# EAGLE schematic motorplank (EAGLE 6.2)
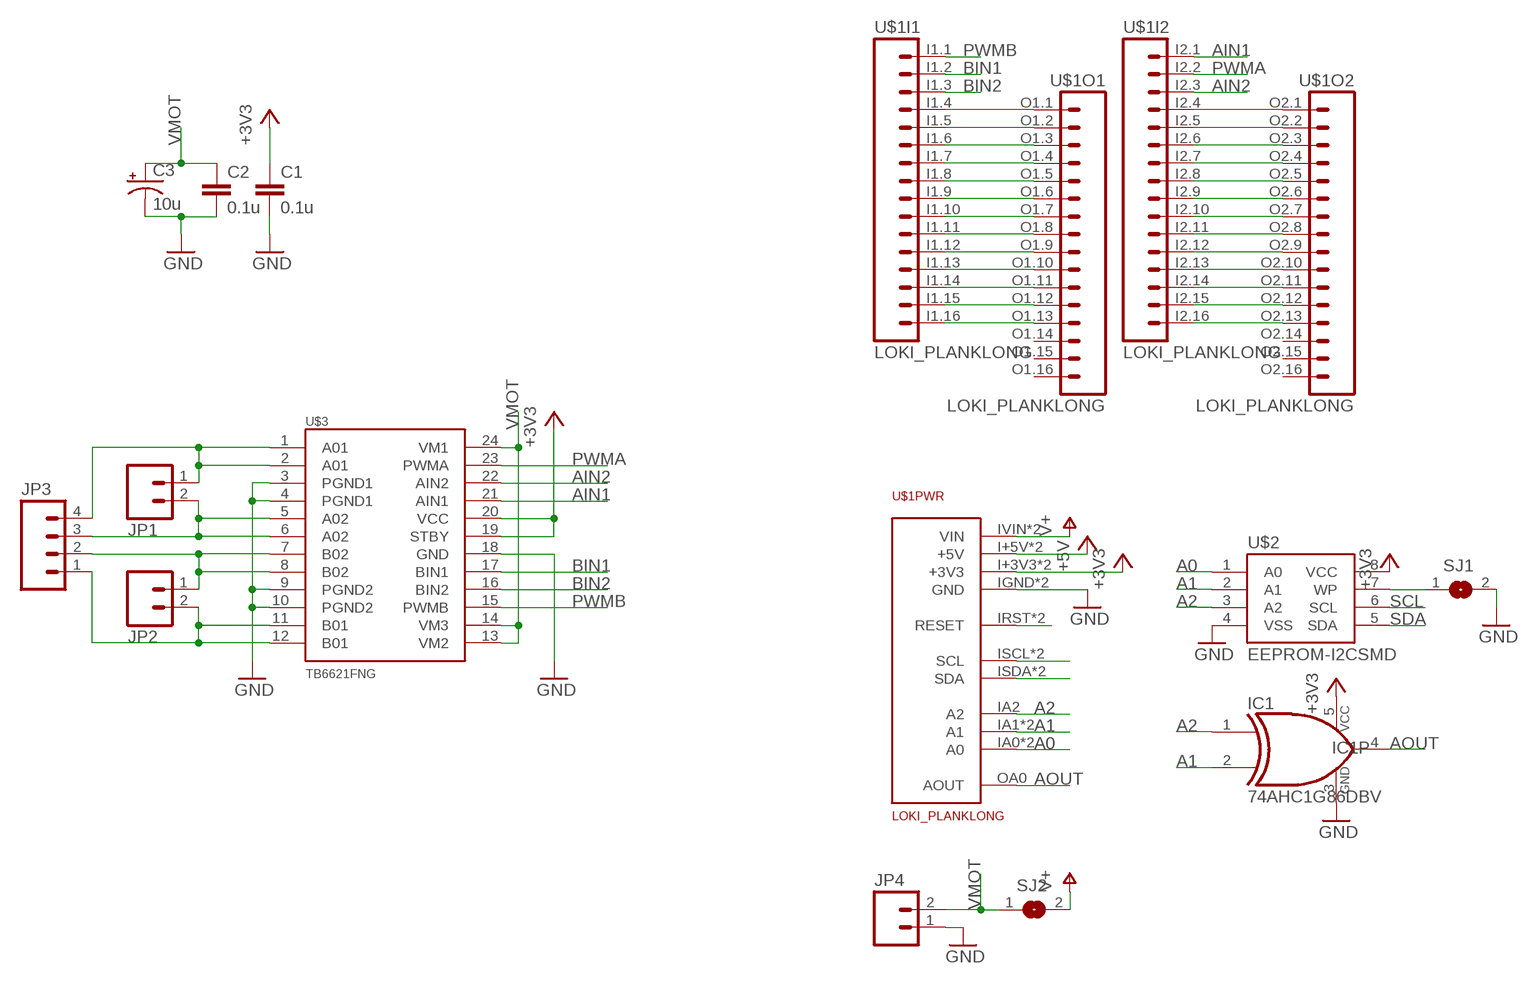
[diagram p0: schematic, sheet 1]

## Parts
C1  0.1u  CAP0603-CAP  [0603-CAP]
C2  0.1u  CAP0603-CAP  [0603-CAP]
C3  10u  CAP_POLC  [PANASONIC_C]
IC1  74AHC1G86DBV  [SOT23-5]
JP1  M023.5MM  [SCREWTERMINAL-3.5MM-2]
JP2  M023.5MM  [SCREWTERMINAL-3.5MM-2]
JP3  M04PTH  [1X04]
JP4  M023.5MM  [SCREWTERMINAL-3.5MM-2]
SJ1  SJ  [SJ]
SJ2  SJ  [SJ]
U$1  LOKI_PLANKLONG  [PLANK_LONG]
U$2  EEPROM-I2CSMD  [SO08]
U$3  TB6621FNG  [SSOP24]

## Nets
+3V3: C1.1 IC1.5(VCC) U$1.I+3V3(PWR:+3V3) U$1.O+3V3(PWR:+3V3) U$2.8(VCC) U$3.19(STBY) U$3.20(VCC)
+5V: U$1.I+5V(PWR:+5V) U$1.O+5V(PWR:+5V)
A0: U$1.IA0(PWR:A0) U$1.OA1(PWR:A0) U$2.1(A0)
A1: IC1.2(I1) U$1.IA1(PWR:A1) U$1.OA2(PWR:A1) U$2.2(A1)
A2: IC1.1(I0) U$1.IA2(PWR:A2) U$2.3(A2)
AIN1: U$1.I2.1 U$3.21(AIN1)
AIN2: U$1.I2.3 U$3.22(AIN2)
AOUT: IC1.4(O) U$1.OA0(PWR:AOUT)
BIN1: U$1.I1.2 U$3.17(BIN1)
BIN2: U$1.I1.3 U$3.16(BIN2)
GND: C1.2 C2.2 C3.- IC1.3(GND) JP4.1 SJ1.2 U$1.IGND(PWR:GND) U$1.OGND(PWR:GND) U$2.4(VSS) U$3.3(PGND1) U$3.4(PGND1) U$3.9(PGND2) U$3.10(PGND2) U$3.18(GND)
N$1: U$1.I1.16 U$1.O1.13
N$2: U$1.I1.15 U$1.O1.12
N$3: U$1.I1.14 U$1.O1.11
N$4: U$1.I1.13 U$1.O1.10
N$5: U$1.I1.12 U$1.O1.9
N$6: U$1.I1.11 U$1.O1.8
N$7: U$1.I1.10 U$1.O1.7
N$8: U$1.I1.9 U$1.O1.6
N$9: U$1.I1.8 U$1.O1.5
N$10: U$1.I1.7 U$1.O1.4
N$11: U$1.I1.6 U$1.O1.3
N$12: U$1.I1.5 U$1.O1.2
N$13: U$1.I1.4 U$1.O1.1
N$14: U$1.I2.16 U$1.O2.13
N$15: U$1.I2.15 U$1.O2.12
N$16: U$1.I2.14 U$1.O2.11
N$17: U$1.I2.13 U$1.O2.10
N$18: U$1.I2.12 U$1.O2.9
N$19: U$1.I2.11 U$1.O2.8
N$20: U$1.I2.10 U$1.O2.7
N$21: U$1.I2.9 U$1.O2.6
N$22: U$1.I2.8 U$1.O2.5
N$23: U$1.I2.7 U$1.O2.4
N$24: U$1.I2.6 U$1.O2.3
N$25: U$1.I2.5 U$1.O2.2
N$26: U$1.I2.4 U$1.O2.1
N$27: JP2.1 JP3.2 U$3.7(B02) U$3.8(B02)
N$28: JP2.2 JP3.1 U$3.11(B01) U$3.12(B01)
N$29: JP1.1 JP3.4 U$3.1(A01) U$3.2(A01)
N$30: JP1.2 JP3.3 U$3.5(A02) U$3.6(A02)
N$31: SJ1.1 U$2.7(WP)
N$32: U$1.IRST(PWR:RESET) U$1.ORST(PWR:RESET)
PWMA: U$1.I2.2 U$3.23(PWMA)
PWMB: U$1.I1.1 U$3.15(PWMB)
SCL: U$1.ISCL(PWR:SCL) U$1.OSCL(PWR:SCL) U$2.6(SCL)
SDA: U$1.ISDA(PWR:SDA) U$1.OSDA(PWR:SDA) U$2.5(SDA)
V+: SJ2.2 U$1.IVIN(PWR:VIN) U$1.OVIN(PWR:VIN)
VMOT: C2.1 C3.+ JP4.2 SJ2.1 U$3.13(VM2) U$3.14(VM3) U$3.24(VM1)
Unconnected: U$1.O1.14 U$1.O1.15 U$1.O1.16 U$1.O2.14 U$1.O2.15 U$1.O2.16

## Library data of the parts
C1 C2 = SparkFun-Passives:CAP: Capacitor Standard 0603 ceramic capacitor, and 0.1" leaded capacitor.
C3 = SparkFun-Passives:CAP_POL: Capacitor Polarized These are standard SMD and PTH capacitors. Normally 10uF, 47uF, and 100uF in electrolytic and tantalum varieties. Always verify the external diameter of the through hole cap, it varies with capacity, voltage, and manufacturer. The EIA devices should be standard.
IC1 = 74xx-little-us:74*1G86: 2-input EXCLUSIV-OR gate
JP1 JP2 JP4 = SparkFun-Connectors:M02: Header 2 Standard 2-pin 0.1" header. Use with straight break away headers (SKU : PRT-00116), right angle break away headers (PRT-00553), swiss pins (PRT-00743), machine pins (PRT-00117), and female headers (PRT-00115). Molex polarized connector foot print use with SKU : PRT-08233 with associated crimp pins and housings.
JP3 = SparkFun-Connectors:M04: Header 4 Standard 4-pin 0.1" header. Use with straight break away headers (SKU : PRT-00116), right angle break away headers (PRT-00553), swiss pins (PRT-00743), machine pins (PRT-00117), and female headers (PRT-00115). Molex polarized connector foot print use with SKU : PRT-08231 with associated crimp pins and housings. 1MM SMD Version SKU: PRT-10208
SJ1 SJ2 = jumper:SJ: SMD solder JUMPER
U$1 = loki:LOKI_PLANK
U$2 = SparkFun-DigitalIC:EEPROM-I2C: I2C EEPROM chips, 24LC256 (and others)
U$3 = SparkFun-PowerIC:TB6621FNG: Toshiba 1A dual motor driver